# EAGLE design serialadapter (EAGLE 5.04)
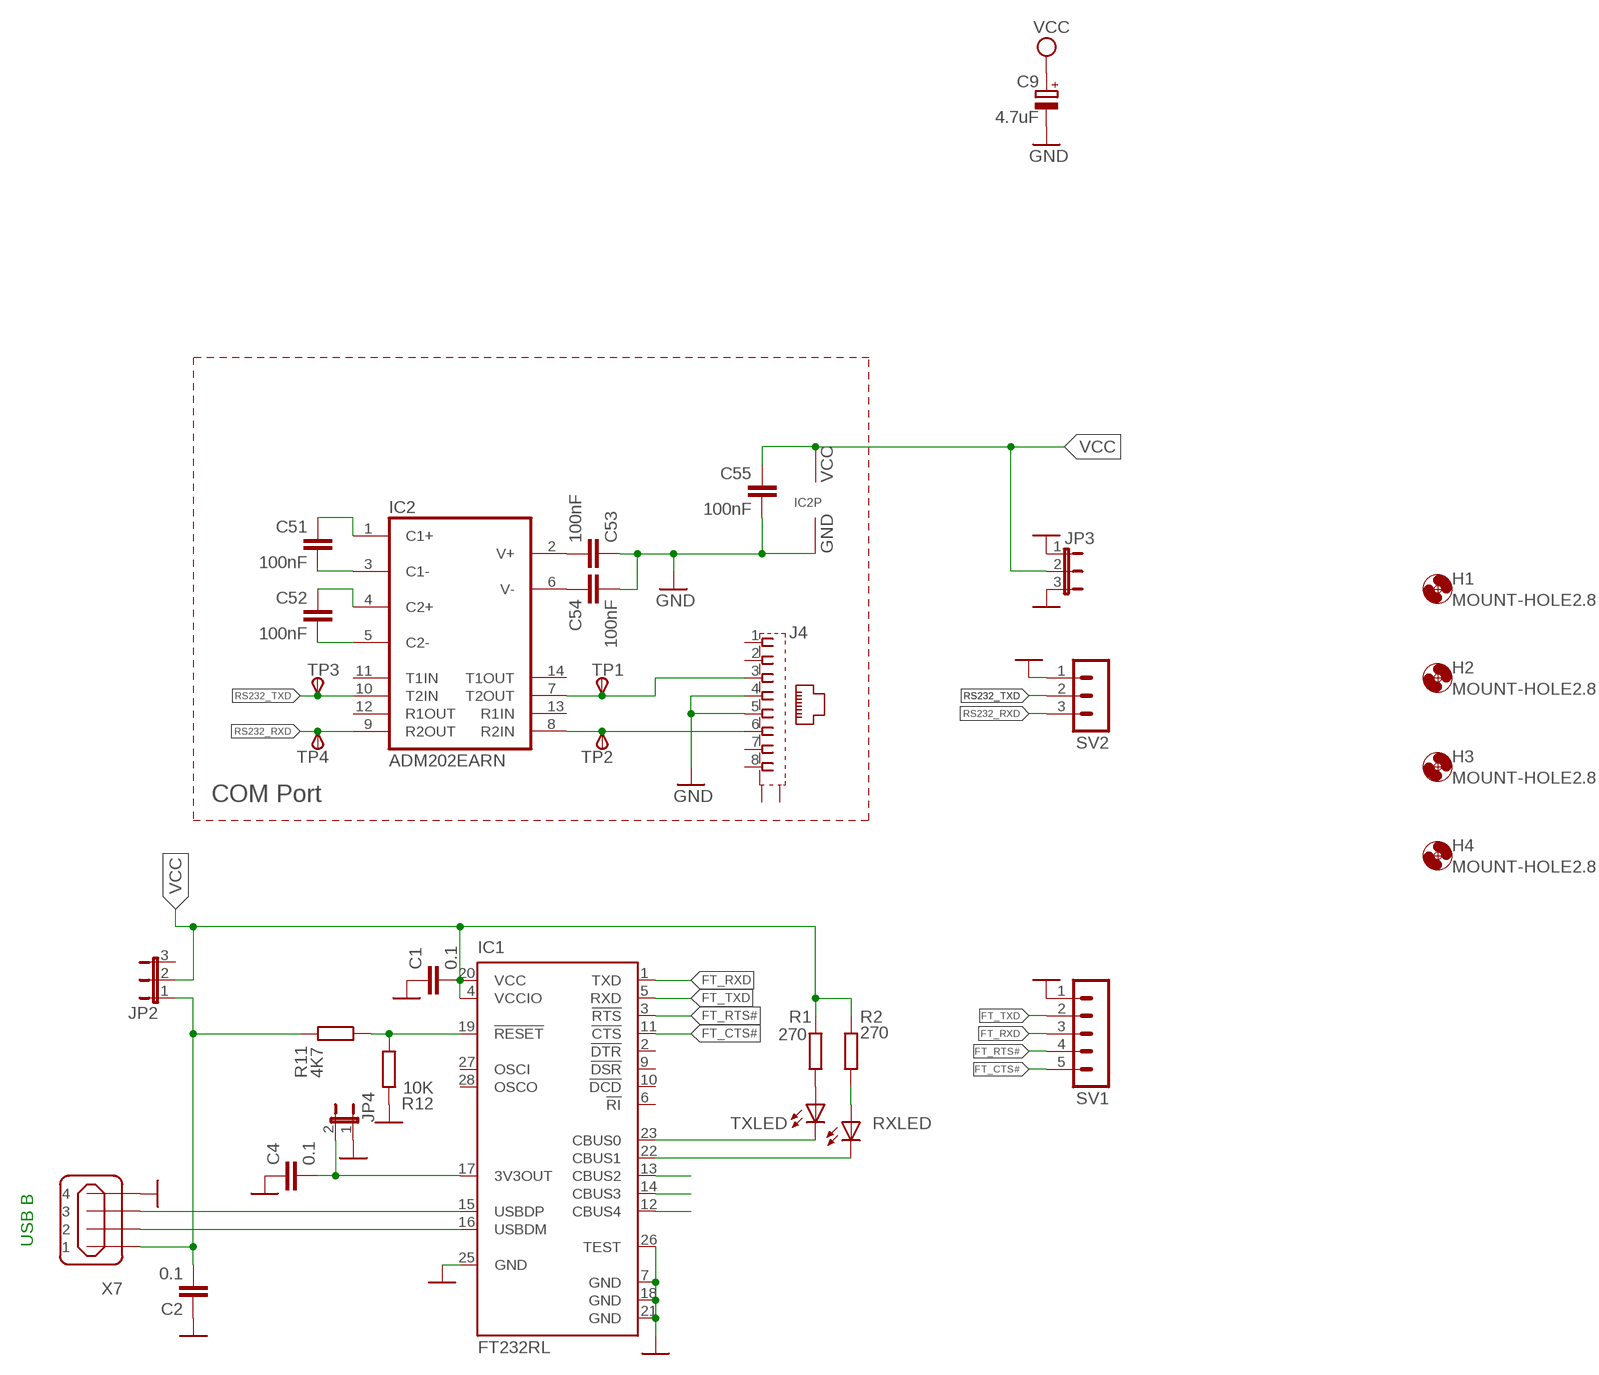
[diagram p0: schematic, sheet 1]

## Parts
C1  0.1  C-EUC0603K  [C0603K]
C2  0.1  C-EUC0603K  [C0603K]
C4  0.1  C-EUC0603K  [C0603K]
C9  4.7uF  CPOL-EUB/3528-21R  [B/3528-21R]
C51  100nF  C-EUC0603K  [C0603K]
C52  100nF  C-EUC0603K  [C0603K]
C53  100nF  C-EUC0603K  [C0603K]
C54  100nF  C-EUC0603K  [C0603K]
C55  100nF  C-EUC0603K  [C0603K]
H1  MOUNT-HOLE2.8  [2,8]
H2  MOUNT-HOLE2.8  [2,8]
H3  MOUNT-HOLE2.8  [2,8]
H4  MOUNT-HOLE2.8  [2,8]
IC1  FT232RL  [SSOP28]
IC2  ADM202EARN  [SO16]
J4  558310-1  [558310-1]
JP2  JP2E  [JP2]
JP3  JP2E  [JP2]
JP4  JP1E  [JP1]
R1  270  R-EU_R0603  [R0603]
R2  270  R-EU_R0603  [R0603]
R11  4K7  R-EU_R0805  [R0805]
R12  10K  R-EU_R0805  [R0805]
RXLED  LEDCHIPLED_0805  [CHIPLED_0805]
SV1  MA05-1  [MA05-1]
SV2  MA03-1  [MA03-1]
TP1  TPSTP18SQ  [TP18SQ]
TP2  TPSTP18SQ  [TP18SQ]
TP3  TPSTP18SQ  [TP18SQ]
TP4  TPSTP18SQ  [TP18SQ]
TXLED  LEDCHIPLED_0805  [CHIPLED_0805]
X7  MINI-USB_SHIELD4P-85-32004-10X  [85-32004-10X]

## Nets
COM_RXD: IC2.8(R2IN) J4.6 TP2.TP(PP)
COM_TXD: IC2.7(T2OUT) J4.3 TP1.TP(PP)
FT_CTS#: IC1.11(!CTS) SV1.5
FT_RTS#: IC1.3(!RTS) SV1.4
FT_RXD: IC1.1(TXD) SV1.3
FT_TXD: IC1.5(RXD) SV1.2
FTDIRESET: IC1.19(!RESET) R11.1 R12.1
GND: C1.1 C2.1 C4.1 C9.- C53.1 C54.2 C55.2 IC1.7(GND) IC1.18(GND) IC1.21(GND) IC1.25(GND) IC1.26(TEST) IC2.15(GND) J4.4 J4.5 JP3.1 JP3.3 JP4.1 R12.2 SV1.1 SV2.1 X7.4
N$1: C4.2 IC1.17(3V3OUT) JP4.2
N$2: IC1.22(CBUS1) RXLED.C
N$3: R1.1 TXLED.A
N$4: C51.2 IC2.3(C1-)
N$5: R2.1 RXLED.A
N$7: C51.1 IC2.1(C1+)
N$8: C52.1 IC2.4(C2+)
N$9: C52.2 IC2.5(C2-)
N$10: C53.2 IC2.2(V+)
N$13: IC1.23(CBUS0) TXLED.C
N$57: C54.1 IC2.6(V-)
PWREN#: IC1.14(CBUS3)
RS232_RXD: IC2.9(R2OUT) SV2.3 TP4.TP(PP)
RS232_TXD: IC2.10(T2IN) SV2.2 TP3.TP(PP)
SLEEP#: IC1.12(CBUS4)
TXDEN: IC1.13(CBUS2)
U5V: C2.2 JP2.1 R11.2 X7.1
U+: IC1.15(USBDP) X7.3
U-: IC1.16(USBDM) X7.2
VCC: C1.2 C9.+ C55.1 IC1.4(VCCIO) IC1.20(VCC) IC2.16(VCC) JP2.2 JP3.2 R1.2 R2.2
Unconnected: IC1.2(!DTR) IC1.6(!RI) IC1.9(!DSR) IC1.10(!DCD) IC1.27(OSCI) IC1.28(OSCO) IC2.11(T1IN) IC2.12(R1OUT) IC2.13(R1IN) IC2.14(T1OUT) J4.1 J4.2 J4.7 J4.8 J4.G1(S2) J4.G2(S1) JP2.3 X7.M1(S1) X7.M2(S2)

## Notes on the sheet
- COM Port
- USB B

## Library data of the parts
C1 C2 C4 C51-C55 = rcl:C-EU: CAPACITOR, European symbol
C9 = rcl:CPOL-EU: POLARIZED CAPACITOR, European symbol
H1-H4 = holes:MOUNT-HOLE: MOUNTING HOLE with drill center marker
IC1 = ftdichip:FT232R: Source: http://www.ftdichip.com/Documents/DataSheets/DS_FT232R_v104.pdf
IC2 = 0-ADI-variety:ADM202E*
J4 = con-amp:558310-1: AMP connector
JP2 JP3 = jumper:JP2E: JUMPER
JP4 = jumper:JP1E: JUMPER
R1 R2 R11 R12 = rcl:R-EU_: RESISTOR, European symbol
RXLED TXLED = led:LED: LED OSRAM: - CHIPLED LG R971, LG N971, LY N971, LG Q971, LY Q971, LO R971, LY R971 LH N974, LH R974 LS Q976, LO Q976, LY Q976 LO Q996 - Hyper CHIPLED LW Q18S LB Q993, LB Q99A, LB R99A - SideLED LS A670, LO A670, LY A670, LG A670, LP A670 LB A673, LV A673, LT A673, LW A673 LH A674 LY A675 LS A676, LA A676, LO A676, LY A676, LW A676 LS A679, LY A679, LG A679 - Hyper Micro SIDELED® LS Y876, LA Y876, LO Y876, LY Y876 LT Y87S - SmartLED LW L88C, LW L88S LB L89C, LB L89S, LG L890 LS L89K, LO L89K, LY L89K LS L896, LA L896, LO L896, LY L896 - TOPLED LS T670, LO T670, LY T670, LG T670, LP T670 LSG T670, LSP T670, LSY T670, LOP T670, LYG T670 LG T671, LOG T671, LSG T671 LB T673, LV T673, LT T673, LW T673 LH T674 LS T676, LA T676, LO T676, LY T676, LB T676, LH T676, LSB T676, LW T676 LB T67C, LV T67C, LT T67C, LS T67K, LO T67K, LY T67K, LW E67C LS E67B, LA E67B, LO E67B, LY E67B, LB E67C, LV E67C, LT E67C LW T67C LS T679, LY T679, LG T679 LS T770, LO T770, LY T770, LG T770, LP T770 LB T773, LV T773, LT T773, LW T773 LH T774 LS E675, LA E675, LY E675, LS T675 LS T776, LA T776, LO T776, LY T776, LB T776 LHGB T686 LT T68C, LB T68C - Hyper Mini TOPLED® LB M676 - Mini TOPLED Santana® LG M470 LS M47K, LO M47K, LY M47K Source: http://www.osram.convergy.de LUXEON: - LUMILED® LXK2-PW12-R00, LXK2-PW12-S00, LXK2-PW14-U00, LXK2-PW14-V00 LXK2-PM12-R00, LXK2-PM12-S00, LXK2-PM14-U00 LXK2-PE12-Q00, LXK2-PE12-R00, LXK2-PE12-S00, LXK2-PE14-T00, LXK2-PE14-U00 LXK2-PB12-K00, LXK2-PB12-L00, LXK2-PB12-M00, LXK2-PB14-N00, LXK2-PB14-P00, LXK2-PB14-Q00 LXK2-PR12-L00, LXK2-PR12-M00, LXK2-PR14-Q00, LXK2-PR14-R00 LXK2-PD12-Q00, LXK2-PD12-R00, LXK2-PD12-S00 LXK2-PH12-R00, LXK2-PH12-S00 LXK2-PL12-P00, LXK2-PL12-Q00, LXK2-PL12-R00 Source: www.luxeon.com KINGBRIGHT: KA-3528ASYC Source: www.kingbright.com
SV1 = con-lstb:MA05-1: PIN HEADER
SV2 = con-lstb:MA03-1: PIN HEADER
TP1-TP4 = testpad:TPS: TEST PIN
X7 = con-cypressindustries:MINI-USB_SHIELD4P-: MINI USB 4 Pol. Source: www.cypressindustries.com

## Board
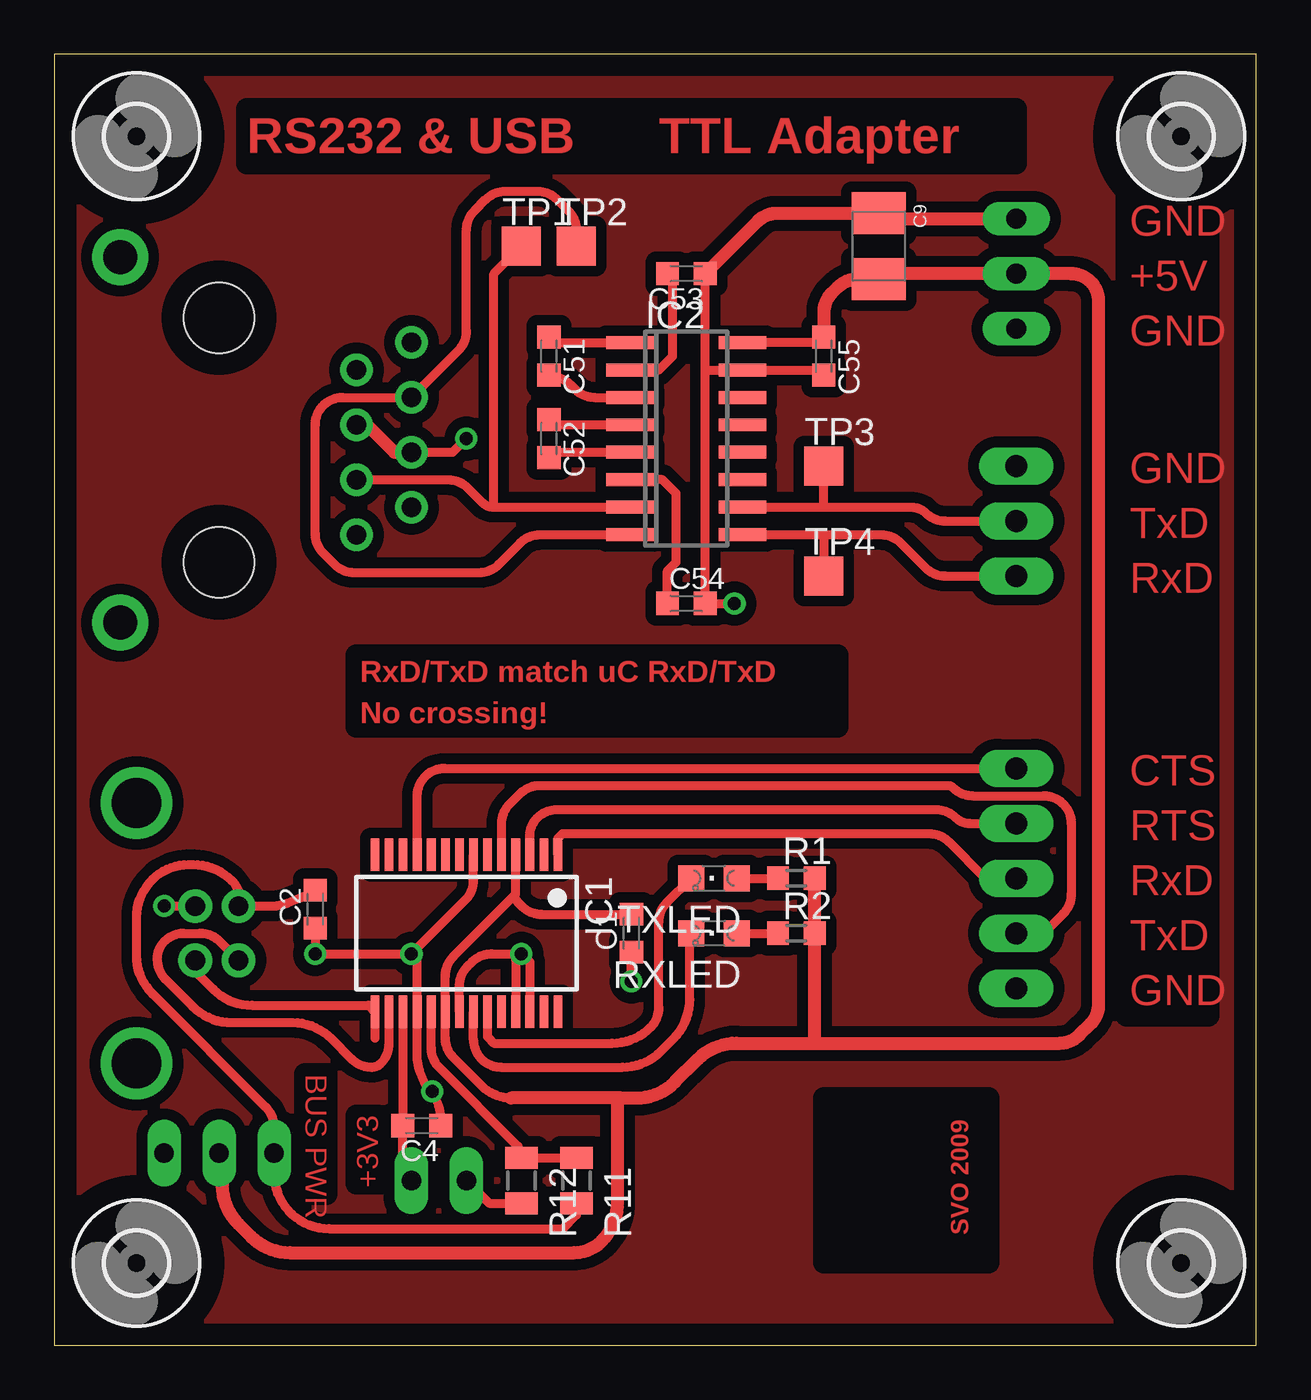
[diagram p1: board, top side]
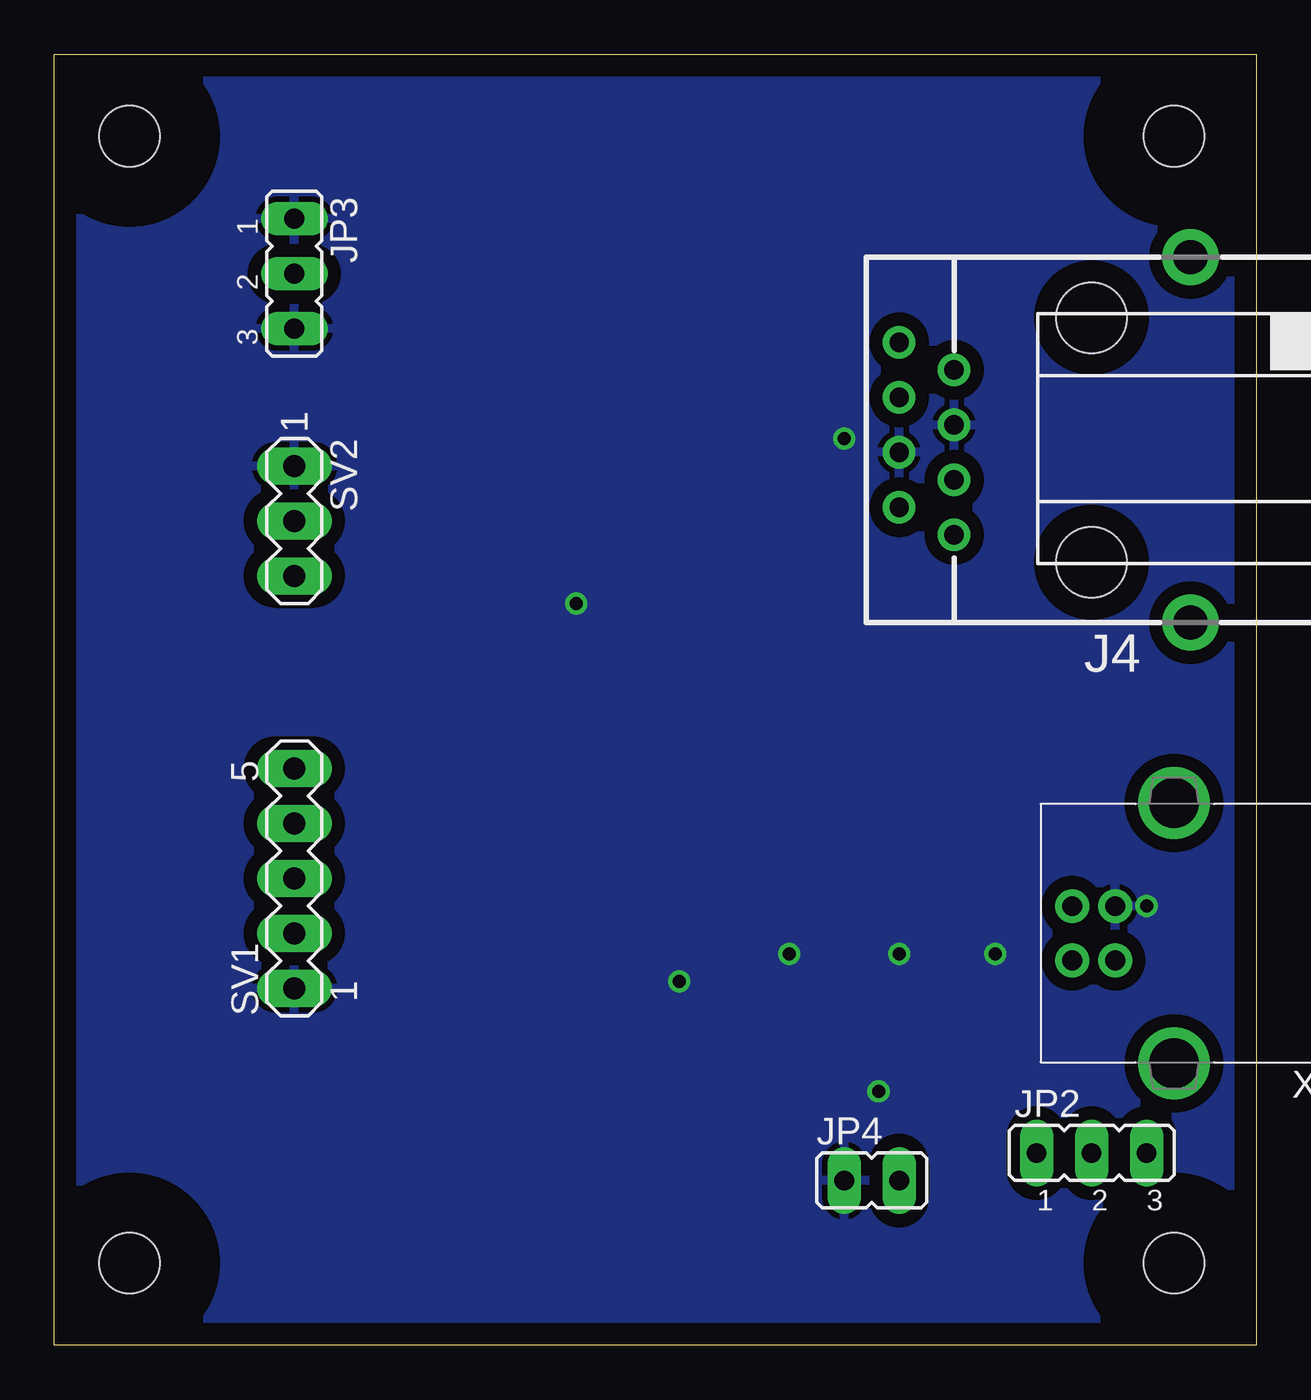
[diagram p2: board, bottom side, seen from below]

Size 55.55 x 59.68 mm. Coordinates in mm from the lower left corner, seen from the top.
Outline: 0,0 55.55,0 55.55,59.68 0,59.68 0,0
Copper layers (1*16): Top 0.035mm / dielectric 1.5mm / Bottom 0.035mm
Design rules "default *": minimum track width 10mil, minimum drill 24mil, track to track 8mil, track to pad 8mil, pad to pad 8mil, via to via 8mil, smd to smd 8mil, copper to edge 40mil, drill to drill 8mil, minimum pad ring 10mil, minimum via ring 8mil, stop-mask expansion 4mil, vias tented up to drill 0mil, thermal gap 10mil
tRestrict: area 8.9,54.6 to 44.5,57.1; area 49.5,15.2 to 53.3,53.3; area 35.6,3.8 to 43.2,11.4; area 14,28.6 to 36.2,31.9

### Footprints (pad centres in the part's own frame; a part is rotated, then mirrored left to right if it is on the bottom)
C0603K = smd 1.05 x 1.08: 1 -0.875,0; 2 0.875,0
B/3528-21R = smd 1.95 x 2.5: + 1.525,0; - -1.525,0
2,8 = hole 2.8: 0,0
SSOP28 = smd 0.4 x 1.5: 1 -4.225,-3.625; 2 -3.575,-3.625; 3 -2.925,-3.625; 4 -2.275,-3.625; 5 -1.625,-3.625; 6 -0.975,-3.625; 7 -0.325,-3.625; 8 0.325,-3.625; 9 0.975,-3.625; 10 1.625,-3.625; 11 2.275,-3.625; 12 2.925,-3.625; 13 3.575,-3.625; 14 4.225,-3.625; 15 4.225,3.625; 16 3.575,3.625; 17 2.925,3.625; 18 2.275,3.625; 19 1.625,3.625; 20 0.975,3.625; 21 0.325,3.625; 22 -0.325,3.625; 23 -0.975,3.625; 24 -1.625,3.625; 25 -2.275,3.625; 26 -2.925,3.625; 27 -3.575,3.625; 28 -4.225,3.625
SO16 = smd 0.6 x 2.2: 1 -4.445,-2.6; 2 -3.175,-2.6; 3 -1.905,-2.6; 4 -0.635,-2.6; 5 0.635,-2.6; 6 1.905,-2.6; 7 3.175,-2.6; 8 4.445,-2.6; 9 4.445,2.6; 10 3.175,2.6; 11 1.905,2.6; 12 0.635,2.6; 13 -0.635,2.6; 14 -1.905,2.6; 15 -3.175,2.6; 16 -4.445,2.6
558310-1 = drill 0.889 round: 1 -4.445,6.35; 2 -3.175,8.89; 3 -1.905,6.35; 4 -0.635,8.89; 5 0.635,6.35; 6 1.905,8.89; 7 3.175,6.35; 8 4.445,8.89 | drill 1.575 pad 2.184 round: G1 -8.509,-4.572; G2 8.382,-4.572 | hole 3.251: -5.715,0; 5.588,0
JP2 = drill 0.914 long: 1 -2.54,0; 2 0,0; 3 2.54,0
JP1 = drill 0.914 long: 1 0,-1.27; 2 0,1.27
R0603 = smd 1 x 1.1: 1 -0.85,0; 2 0.85,0
R0805 = smd 1 x 1.5: 1 -1.05,0; 2 1.05,0
CHIPLED_0805 = smd 1.2 x 1.2: A 0,-1.05; C 0,1.05
MA05-1 = drill 1.016 long: 1 -5.08,0; 2 -2.54,0; 3 0,0; 4 2.54,0; 5 5.08,0
MA03-1 = drill 1.016 long: 1 -2.54,0; 2 0,0; 3 2.54,0
TP18SQ = smd 1.8 x 1.8: TP 0,0
85-32004-10X = drill 0.92 pad 1.27 round: 1 4.71,-1.25; 2 4.71,1.25; 3 2.71,1.25; 4 2.71,-1.25 | drill 2.3 pad 3 round: M1 0,6.02; M2 0,-6.02

### Placement (x,y rotation side)
C1  26.67,19.05 90 top
C2  12.06,20.16 90 top
C4  16.99,10.16 180 top
C9  38.1,50.8 270 top
C51  22.86,45.72 270 top
C52  22.86,41.91 270 top
C53  29.21,49.53 180 top
C54  29.21,34.29 0 top
C55  35.56,45.72 270 top
H1  52.07,3.81 0 top
H2  3.81,55.88 0 top
H3  52.07,55.88 0 top
H4  3.81,3.81 0 top
IC1  19.05,19.05 180 top
IC2  29.21,41.91 270 top
J4  7.62,41.91 90 bottom
JP2  7.62,8.89 0 bottom
JP3  44.45,49.53 270 bottom
JP4  17.78,7.62 270 bottom
R1  34.29,21.59 0 top
R2  34.29,19.05 0 top
R11  24.13,7.62 270 top
R12  21.59,7.62 270 top
RXLED  30.48,19.05 90 top
SV1  44.45,21.59 90 bottom
SV2  44.45,38.1 270 bottom
TP1  21.59,50.8 0 top
TP2  24.13,50.8 0 top
TP3  35.56,40.64 0 top
TP4  35.56,35.56 0 top
TXLED  30.48,21.59 90 top
X7  3.81,19.05 180 bottom

### Tracks (layer width: path | path; a pad name or v marks a point on that pad's centre or on a via)
COM_RXD
  Top 0.406: IC2.8 22.43,37.47 arc45 21.54,37.09 20.53,36.09 arc-45 19.64,35.72 13.86,35.72 arc-45 12.96,36.09 12.44,36.62 arc-45 12.06,37.52 12.06,42.55 arc-90 13.34,43.81 J4.6 18.68,45.98 arc45 19.05,46.88 19.05,51.54 arc-45 19.42,52.44 19.95,52.97 arc-45 20.85,53.34 22.33,53.34 arc-45 23.23,52.97 23.76,52.44 arc-45 24.13,51.54 TP2.TP
COM_TXD
  Top 0.406: 20.32,38.73 IC2.7 | J4.3 18.21,40.01 arc-45 19.11,39.63 19.78,38.96 arc45 20.32,38.73 | TP1.TP 20.32,49.53 20.32,38.73
FT_CTS#
  Top 0.406: IC1.11 16.77,25.4 arc-90 18.05,26.67 SV1.5
FT_RTS#
  Top 0.406: IC1.3 21.98,23.54 arc-45 22.33,24.39 arc-45 23.23,24.77 40.75,24.77 arc-45 41.65,24.39 arc45 42.28,24.13 SV1.4
FT_RXD
  Top 0.406: IC1.1 23.27,23.43 23.5,23.65 40.43,23.65 arc-45 41.33,23.28 43.02,21.59 SV1.3
FT_TXD
  Top 0.406: SV1.2 45.72,19.05 46.62,19.95 arc45 46.99,20.85 46.99,24.13 arc90 45.72,25.4 42.44,25.4 arc-45 41.54,25.77 arc45 41.29,25.88 22.43,25.88 arc45 21.54,25.5 21.05,25.02 arc45 20.68,24.12 IC1.5
FTDIRESET
  Top 0.406: R11.1 R12.1 21.43,8.83 21.43,9.21 17.8,12.84 arc-45 17.43,13.74 IC1.19
GND  (via drill 0.6)
  Top 0.406: C2.1 v12.06,18.1 v16.51,18.1 19,20.59 arc45 19.38,21.49 IC1.7 | C55.2 35.32,45.09 IC2.15 30.09,45.09 | 30.09,34.77 30.09,45.09 | 30.09,45.09 C53.1 | v26.67,16.83 C1.1 | IC1.25 21.32,17.83 v21.59,18.1 | IC1.26 21.98,17.71 v21.59,18.1 | IC1.21 18.73,16.61 arc-45 19.1,17.51 19.31,17.73 arc-45 20.21,18.1 v21.59,18.1 | v17.46,11.75 17.49,11.72 17.77,11.06 17.86,10.57 C4.1 | R12.2 20.1,6.57 JP4.1 | C54.2 v31.43,34.29 | J4.4 18.41,41.27 v19.05,41.91 | v5.08,20.32 6.51,20.32 | 16.77,17.83 IC1.18 16.77,13.21 16.87,12.73 17.15,12.06 v17.46,11.75 | v17.46,11.75
  Top 0.61: JP3.1 38.35,52.07 C9.- 33.41,52.33 arc45 32.51,51.95 C53.1 | J4.5 14.45,42.55 15.72,41.27 J4.4
  pour Bottom (isolate 0.61): -1.27,60.96 -1.27,-2.54 57.15,-2.54 58.42,-1.27 58.42,60.96
N$1
  Top 0.406: IC1.17 16.12,10.94 C4.2 16.11,8.02 JP4.2
N$2
  Top 0.406: IC1.22 19.38,14.13 arc90 20.64,12.86 26.25,12.86 arc45 28.05,13.6 28.62,14.18 arc45 29.37,15.97 29.37,18.99 RXLED.C
N$3
  Top 0.406: TXLED.A R1.1
N$4
  Top 0.406: IC2.3 24.97,43.81 arc-45 24.08,44.19 23.87,44.4 arc45 22.97,44.77 22.94,44.77 C51.2
N$5
  Top 0.406: RXLED.A R2.1
N$6
  pour Top (isolate 0.5): 0,59.69 55.88,59.69 55.88,0 0,0
N$7
  Top 0.406: IC2.1 23.1,46.35 C51.1
N$8
  Top 0.406: IC2.4 23.1,42.55 C52.1
N$9
  Top 0.406: IC2.5 23.1,41.27 C52.2
N$10
  Top 0.406: IC2.2 27.94,45.09 28.57,45.72 28.57,49.29 C53.2
N$13
  Top 0.406: IC1.23 20.02,14.27 20.32,13.97 25.78,13.97 arc45 27.57,14.71 arc45 27.94,15.6 27.94,19.57 arc-45 28.31,20.47 TXLED.C
N$57
  Top 0.406: C54.1 28.34,35.8 28.73,36.2 28.73,39.37 28.1,40.01 IC2.6
RS232_RXD
  Top 0.406: IC2.9 35.56,37.47 | 35.56,37.47 38.21,37.47 arc-45 39.11,37.09 40.27,35.93 arc45 41.17,35.56 SV2.3 | 35.56,37.47 TP4.TP
RS232_TXD
  Top 0.406: IC2.10 35.56,38.73 | 35.56,38.73 39.63,38.73 arc-45 40.27,38.47 arc45 41.17,38.1 SV2.2 | 35.56,38.73 TP3.TP
U5V
  Top 0.406: R11.2 24.13,6.03 23.5,5.4 12.7,5.4 arc-90 10.16,7.94 JP2.1 10.16,10.11 arc45 9.79,11.01 4.55,16.24 arc-45 3.81,18.04 3.81,19.74 arc-45 4.55,21.54 arc-45 6.21,22.23 6.41,22.23 arc-45 8.21,21.48 arc-45 8.57,20.59 8.57,20.35 X7.1 10.06,20.3 arc11 10.31,20.32 10.55,20.37 arc11 10.79,20.45 11.4,20.7 arc-22 11.89,20.8 11.98,20.8 C2.2
U+
  Top 0.406: 14.82,14.19 IC1.15 14.53,15.72 9.15,15.72 arc-45 7.35,16.46 6.51,17.3 X7.3
U-
  Top 0.406: IC1.16 15.47,13.94 arc-45 15.1,13.04 arc-45 14.67,12.86 14.65,12.86 arc-45 13.76,13.23 12.81,14.18 arc45 11.01,14.92 8.2,14.92 arc-45 6.4,15.67 5.13,16.93 arc-45 4.76,17.83 arc-90 5.98,19.05 6.74,19.05 arc-45 7.64,18.68 X7.2
VCC
  Top 0.406: IC1.4 21.32,20.85 21.19,20.72 | 21.19,20.72 18.45,17.97 arc45 18.07,17.07 IC1.20 18.07,14.2 arc45 18.45,13.3 19.76,11.99 arc45 21.11,11.43 | IC2.16 35.32,46.35 C55.1 | 21.19,20.72 21.61,20.3 arc45 22.51,19.93 C1.2
  Top 0.61: R1.2 R2.2 35.14,14.03 35.08,13.97 | C55.1 35.56,47.73 arc-45 35.93,48.63 36.2,48.9 arc-45 37.1,49.27 C9.+ 38.35,49.53 JP3.2 46.99,49.53 arc-90 48.26,48.26 48.26,15.77 arc-45 47.89,14.87 47.36,14.34 arc-45 46.46,13.97 35.08,13.97 | 35.08,13.97 31.53,13.97 arc45 29.74,13.23 28.68,12.17 arc-45 26.89,11.43 26.19,11.43 | 26.19,11.43 21.11,11.43 | 26.19,11.43 26.04,11.27 26.04,6.61 arc-45 25.29,4.81 arc-45 24.02,4.29 10.89,4.29 arc-45 9.1,5.03 8.52,5.61 arc-45 7.78,7.4 7.78,7.46 JP2.2

### Text on the board
Top: RS232 & USB | TTL Adapter | GND | +5V | GND | GND | TxD | RxD | RxD/TxD match uC RxD/TxD | No crossing! | CTS | RTS | RxD | TxD | GND | BUS PWR | +3V3 | SVO 2009